# EAGLE schematic car-dashboard_v1 (EAGLE 6.5.0)

## Sheet 1 of 3
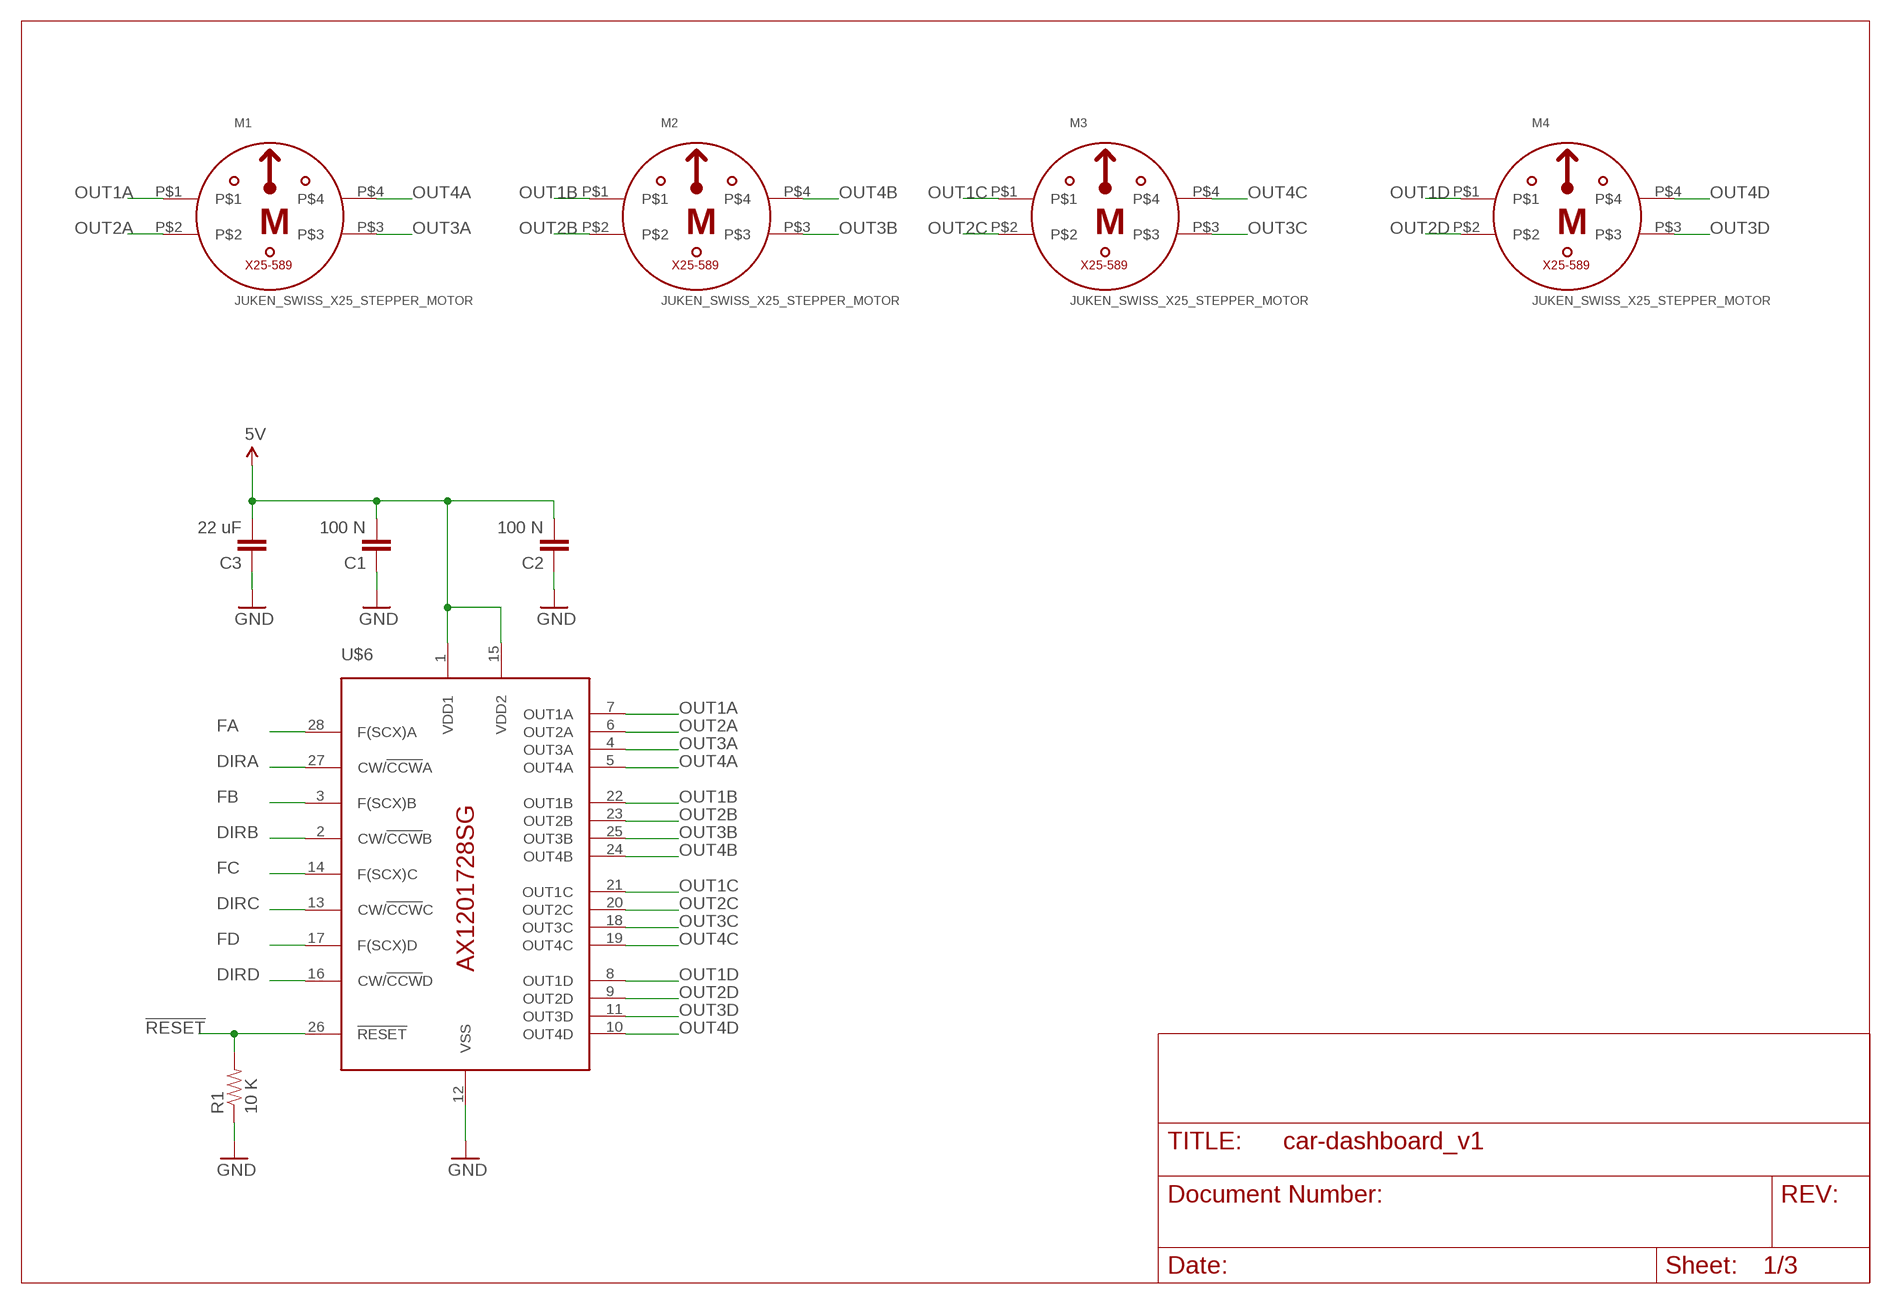
[diagram p0: schematic, sheet 1]

### Parts
C1  100 N  CAP0805  [C0805]
C2  100 N  CAP0805  [C0805]
C3  22 uF  CAP0805  [C0805]
M1  JUKEN_SWISS_X25_STEPPER_MOTOR  [X25_STEPPER_MOTOR]
M2  JUKEN_SWISS_X25_STEPPER_MOTOR  [X25_STEPPER_MOTOR]
M3  JUKEN_SWISS_X25_STEPPER_MOTOR  [X25_STEPPER_MOTOR]
M4  JUKEN_SWISS_X25_STEPPER_MOTOR  [X25_STEPPER_MOTOR]
R1  10 K  RESISTOR0805-RES  [0805]
U$6  AX1201728SG-X25_DRIVER  [SOL-28]

### Nets
5V: C1.2 C2.2 C3.2 U$6.1(VDD1) U$6.15(VDD2) ; also sheet 2,3
!RESET: R1.2 U$6.26(!RESET) ; also sheet 2
DIRA: U$6.27(CW/!CCW!A) ; also sheet 2
DIRB: U$6.2(CW/!CCW!B) ; also sheet 2
DIRC: U$6.13(CW/!CCW!C) ; also sheet 2
DIRD: U$6.16(CW/!CCW!D) ; also sheet 2
FA: U$6.28(F(SCX)A) ; also sheet 2
FB: U$6.3(F(SCX)B) ; also sheet 2
FC: U$6.14(F(SCX)C) ; also sheet 2
FD: U$6.17(F(SCX)D) ; also sheet 2
GND: C1.1 C2.1 C3.1 R1.1 U$6.12(VSS) ; also sheet 2,3
OUT1A: M1.P$1 U$6.7(OUT1A)
OUT1B: M2.P$1 U$6.22(OUT1B)
OUT1C: M3.P$1 U$6.21(OUT1C)
OUT1D: M4.P$1 U$6.8(OUT1D)
OUT2A: M1.P$2 U$6.6(OUT2A)
OUT2B: M2.P$2 U$6.23(OUT2B)
OUT2C: M3.P$2 U$6.20(OUT2C)
OUT2D: M4.P$2 U$6.9(OUT2D)
OUT3A: M1.P$3 U$6.4(OUT3A)
OUT3B: M2.P$3 U$6.25(OUT3B)
OUT3C: M3.P$3 U$6.18(OUT3C)
OUT3D: M4.P$3 U$6.11(OUT3D)
OUT4A: M1.P$4 U$6.5(OUT4A)
OUT4B: M2.P$4 U$6.24(OUT4B)
OUT4C: M3.P$4 U$6.19(OUT4C)
OUT4D: M4.P$4 U$6.10(OUT4D)

## Sheet 2 of 3
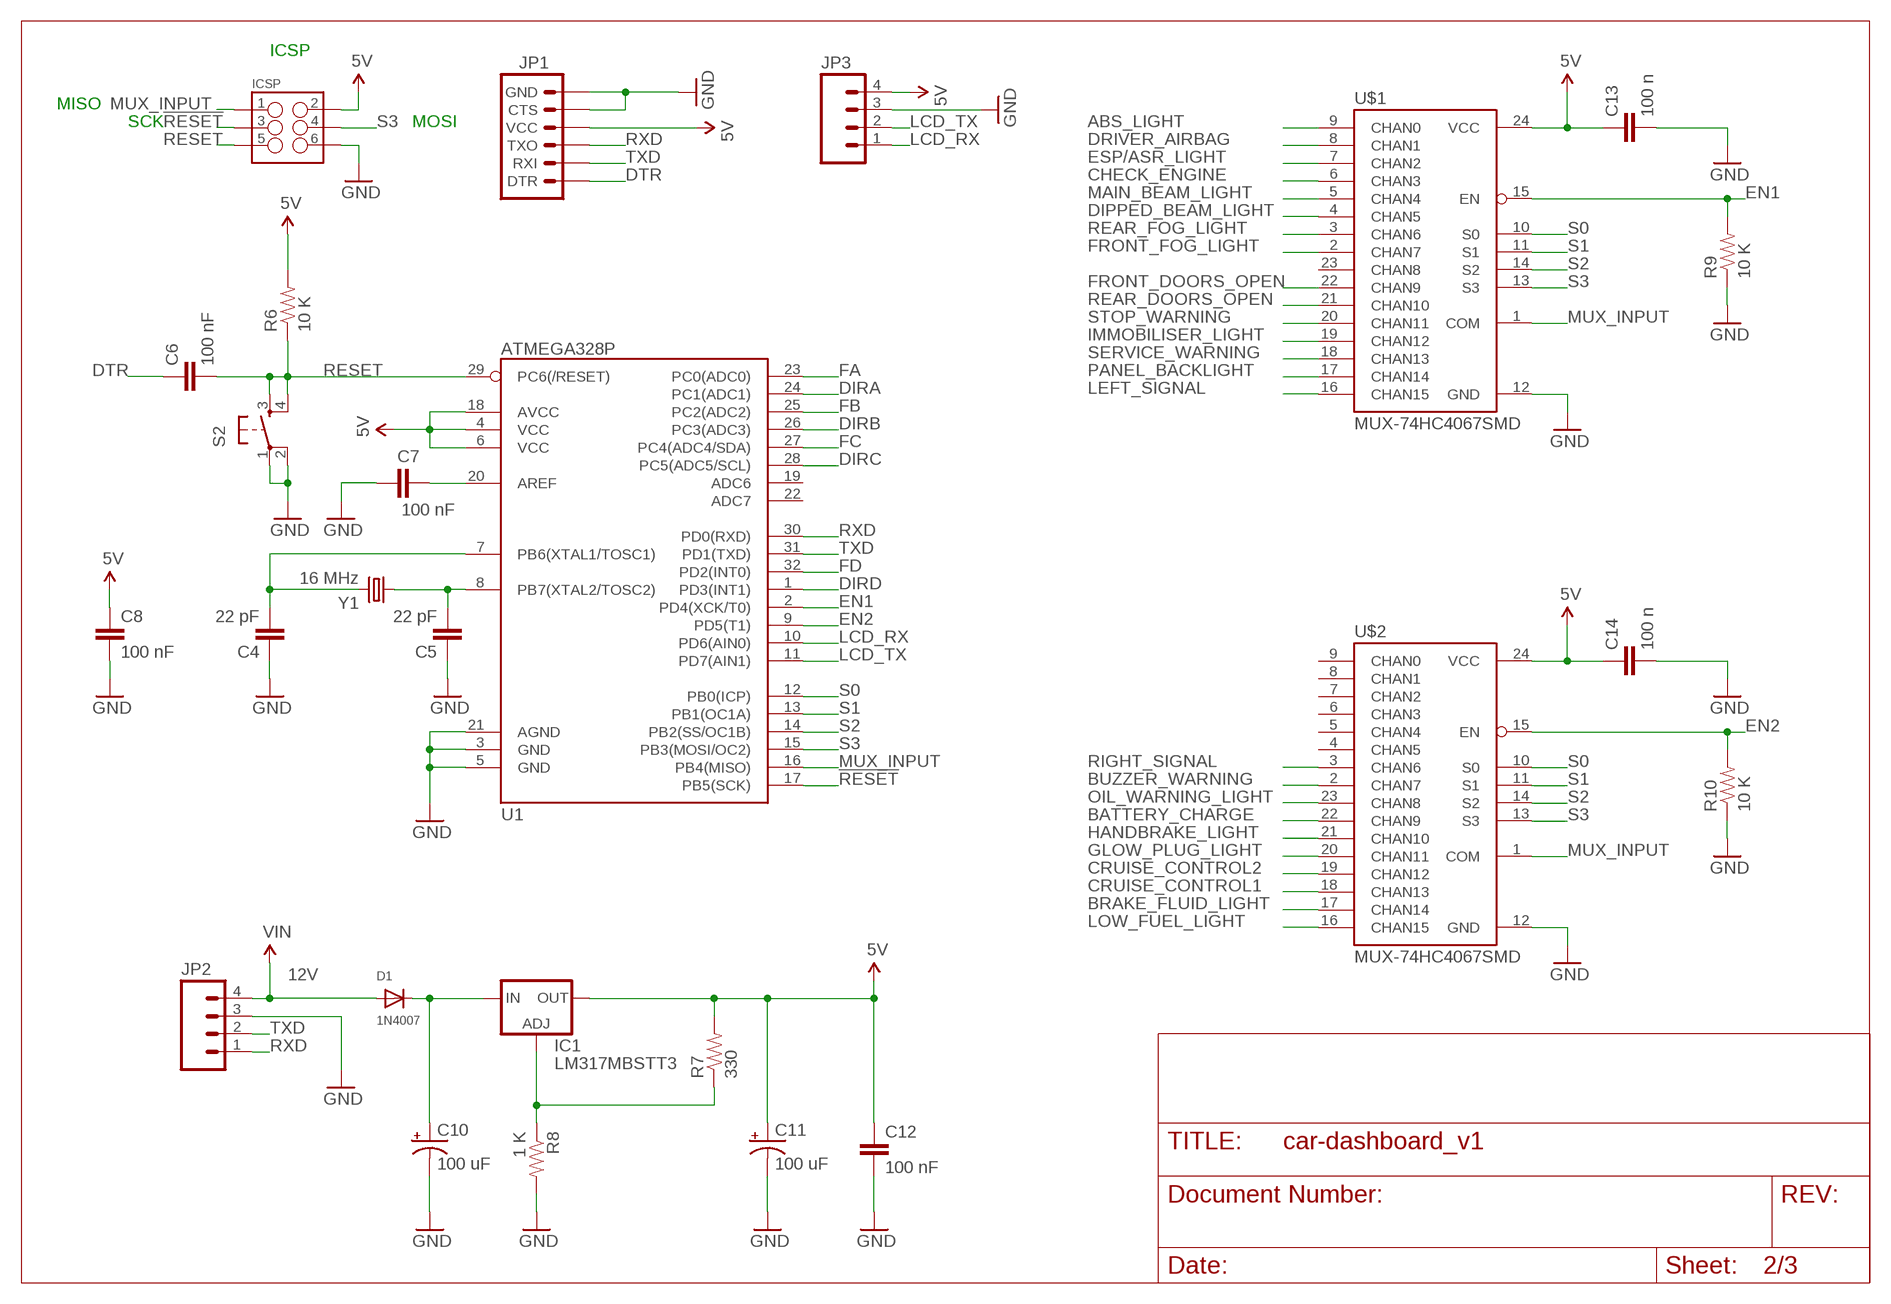
[diagram p1: schematic, sheet 2]

### Parts
C4  22 pF  CAPC0805  [C0805]
C5  22 pF  CAPC0805  [C0805]
C6  100 nF  CAPC0805  [C0805]
C7  100 nF  CAPC0805  [C0805]
C8  100 nF  CAPC0805  [C0805]
C10  100 uF  CPOL-USF  [PANASONIC_F]
C11  100 uF  CPOL-USF  [PANASONIC_F]
C12  100 nF  CAPC0805  [C0805]
C13  100 n  CAP0805  [C0805]
C14  100 n  CAP0805  [C0805]
D1  1N4007  DIODESMA  [SMADIODE]
IC1  LM317MBSTT3  [SOT223]
ICSP  M03X22X3_SILK_SM  [2X3]
JP1  ARDUINO_SERIAL_PROGRAMPTH  [1X06]
JP2  M04POLAR  [MOLEX-1X4]
JP3  M04POLAR  [MOLEX-1X4]
R6  10 K  RESISTOR0805-RES  [R0805]
R7  330  RESISTOR0805-RES  [R0805]
R8  1 K  RESISTOR0805-RES  [R0805]
R9  10 K  RESISTOR0805-RES  [R0805]
R10  10 K  RESISTOR0805-RES  [R0805]
S2  TAC_SWITCHPTH  [TACTILE-PTH]
U1  ATMEGA328P  ATMEGA328_SMT  [TQFP32-08]
U$1  MUX-74HC4067SMD  [SSOP24]
U$2  MUX-74HC4067SMD  [SSOP24]
Y1  16 MHz  CRYSTALSMD  [HC49UP]

### Nets
5V: C8.1 C11.+ C12.1 C13.1 C14.1 IC1.4(OUT) ICSP.2 JP1.4(VCC) JP3.4 R6.2 R7.2 U1.4(VCC) U1.6(VCC) U1.18(AVCC) U$1.24(VCC) U$2.24(VCC) ; also sheet 1,3
12V: D1.A JP2.4 ; supply symbol labelled VIN
!RESET: ICSP.3 U1.17(PB5(SCK)) ; also sheet 1
ABS_LIGHT: U$1.9(CHAN0) ; also sheet 3
BATTERY_CHARGE: U$2.22(CHAN9) ; also sheet 3
BRAKE_FLUID_LIGHT: U$2.17(CHAN14) ; also sheet 3
BUZZER_WARNING: U$2.2(CHAN7) ; also sheet 3
CHECK_ENGINE: U$1.6(CHAN3) ; also sheet 3
CRUISE_CONTROL1: U$2.18(CHAN13) ; also sheet 3
CRUISE_CONTROL2: U$2.19(CHAN12) ; also sheet 3
DIPPED_BEAM_LIGHT: U$1.4(CHAN5) ; also sheet 3
DIRA: U1.24(PC1(ADC1)) ; also sheet 1
DIRB: U1.26(PC3(ADC3)) ; also sheet 1
DIRC: U1.28(PC5(ADC5/SCL)) ; also sheet 1
DIRD: U1.1(PD3(INT1)) ; also sheet 1
DRIVER_AIRBAG: U$1.8(CHAN1) ; also sheet 3
DTR: C6.1 JP1.1(DTR)
EN1: R9.2 U1.2(PD4(XCK/T0)) U$1.15(EN)
EN2: R10.2 U1.9(PD5(T1)) U$2.15(EN)
ESP/ASR_LIGHT: U$1.7(CHAN2) ; also sheet 3
FA: U1.23(PC0(ADC0)) ; also sheet 1
FB: U1.25(PC2(ADC2)) ; also sheet 1
FC: U1.27(PC4(ADC4/SDA)) ; also sheet 1
FD: U1.32(PD2(INT0)) ; also sheet 1
FRONT_DOORS_OPEN: U$1.22(CHAN9) ; also sheet 3
FRONT_FOG_LIGHT: U$1.2(CHAN7) ; also sheet 3
GLOW_PLUG_LIGHT: U$2.20(CHAN11) ; also sheet 3
GND: C4.1 C5.1 C7.1 C8.2 C10.- C11.- C12.2 C13.2 C14.2 ICSP.6 JP1.5(CTS) JP1.6(GND) JP2.3 JP3.3 R8.2 R9.1 R10.1 S2.1 S2.2 U1.3(GND) U1.5(GND) U1.21(AGND) U$1.12(GND) U$2.12(GND) ; also sheet 1,3
HANDBRAKE_LIGHT: U$2.21(CHAN10) ; also sheet 3
IMMOBILISER_LIGHT: U$1.19(CHAN12) ; also sheet 3
LCD_RX: JP3.1 U1.10(PD6(AIN0))
LCD_TX: JP3.2 U1.11(PD7(AIN1))
LEFT_SIGNAL: U$1.16(CHAN15) ; also sheet 3
LOW_FUEL_LIGHT: U$2.16(CHAN15) ; also sheet 3
MAIN_BEAM_LIGHT: U$1.5(CHAN4) ; also sheet 3
MUX_INPUT: ICSP.1 U1.16(PB4(MISO)) U$1.1(COM) U$2.1(COM)
N$1: C4.2 U1.7(PB6(XTAL1/TOSC1)) Y1.2
N$3: C5.2 U1.8(PB7(XTAL2/TOSC2)) Y1.1
N$5: C10.+ D1.C IC1.3(IN)
N$9: C7.2 U1.20(AREF)
N$10: IC1.1(ADJ) R7.1 R8.1
OIL_WARNING_LIGHT: U$2.23(CHAN8) ; also sheet 3
PANEL_BACKLIGHT: U$1.17(CHAN14) ; also sheet 3
REAR_DOORS_OPEN: U$1.21(CHAN10) ; also sheet 3
REAR_FOG_LIGHT: U$1.3(CHAN6) ; also sheet 3
RESET: C6.2 ICSP.5 R6.1 S2.3 S2.4 U1.29(PC6(/RESET))
RIGHT_SIGNAL: U$2.3(CHAN6) ; also sheet 3
RXD: JP1.3(TXO) JP2.1 U1.30(PD0(RXD))
S0: U1.12(PB0(ICP)) U$1.10(S0) U$2.10(S0)
S1: U1.13(PB1(OC1A)) U$1.11(S1) U$2.11(S1)
S2: U1.14(PB2(SS/OC1B)) U$1.14(S2) U$2.14(S2)
S3: ICSP.4 U1.15(PB3(MOSI/OC2)) U$1.13(S3) U$2.13(S3)
SERVICE_WARNING: U$1.18(CHAN13) ; also sheet 3
STOP_WARNING: U$1.20(CHAN11) ; also sheet 3
TXD: JP1.2(RXI) JP2.2 U1.31(PD1(TXD))
Unconnected: U1.19(ADC6) U1.22(ADC7) U$1.23(CHAN8) U$2.4(CHAN5) U$2.5(CHAN4) U$2.6(CHAN3) U$2.7(CHAN2) U$2.8(CHAN1) U$2.9(CHAN0)

### Notes on the sheet
- ICSP
- MISO
- SCK | MOSI

## Sheet 3 of 3
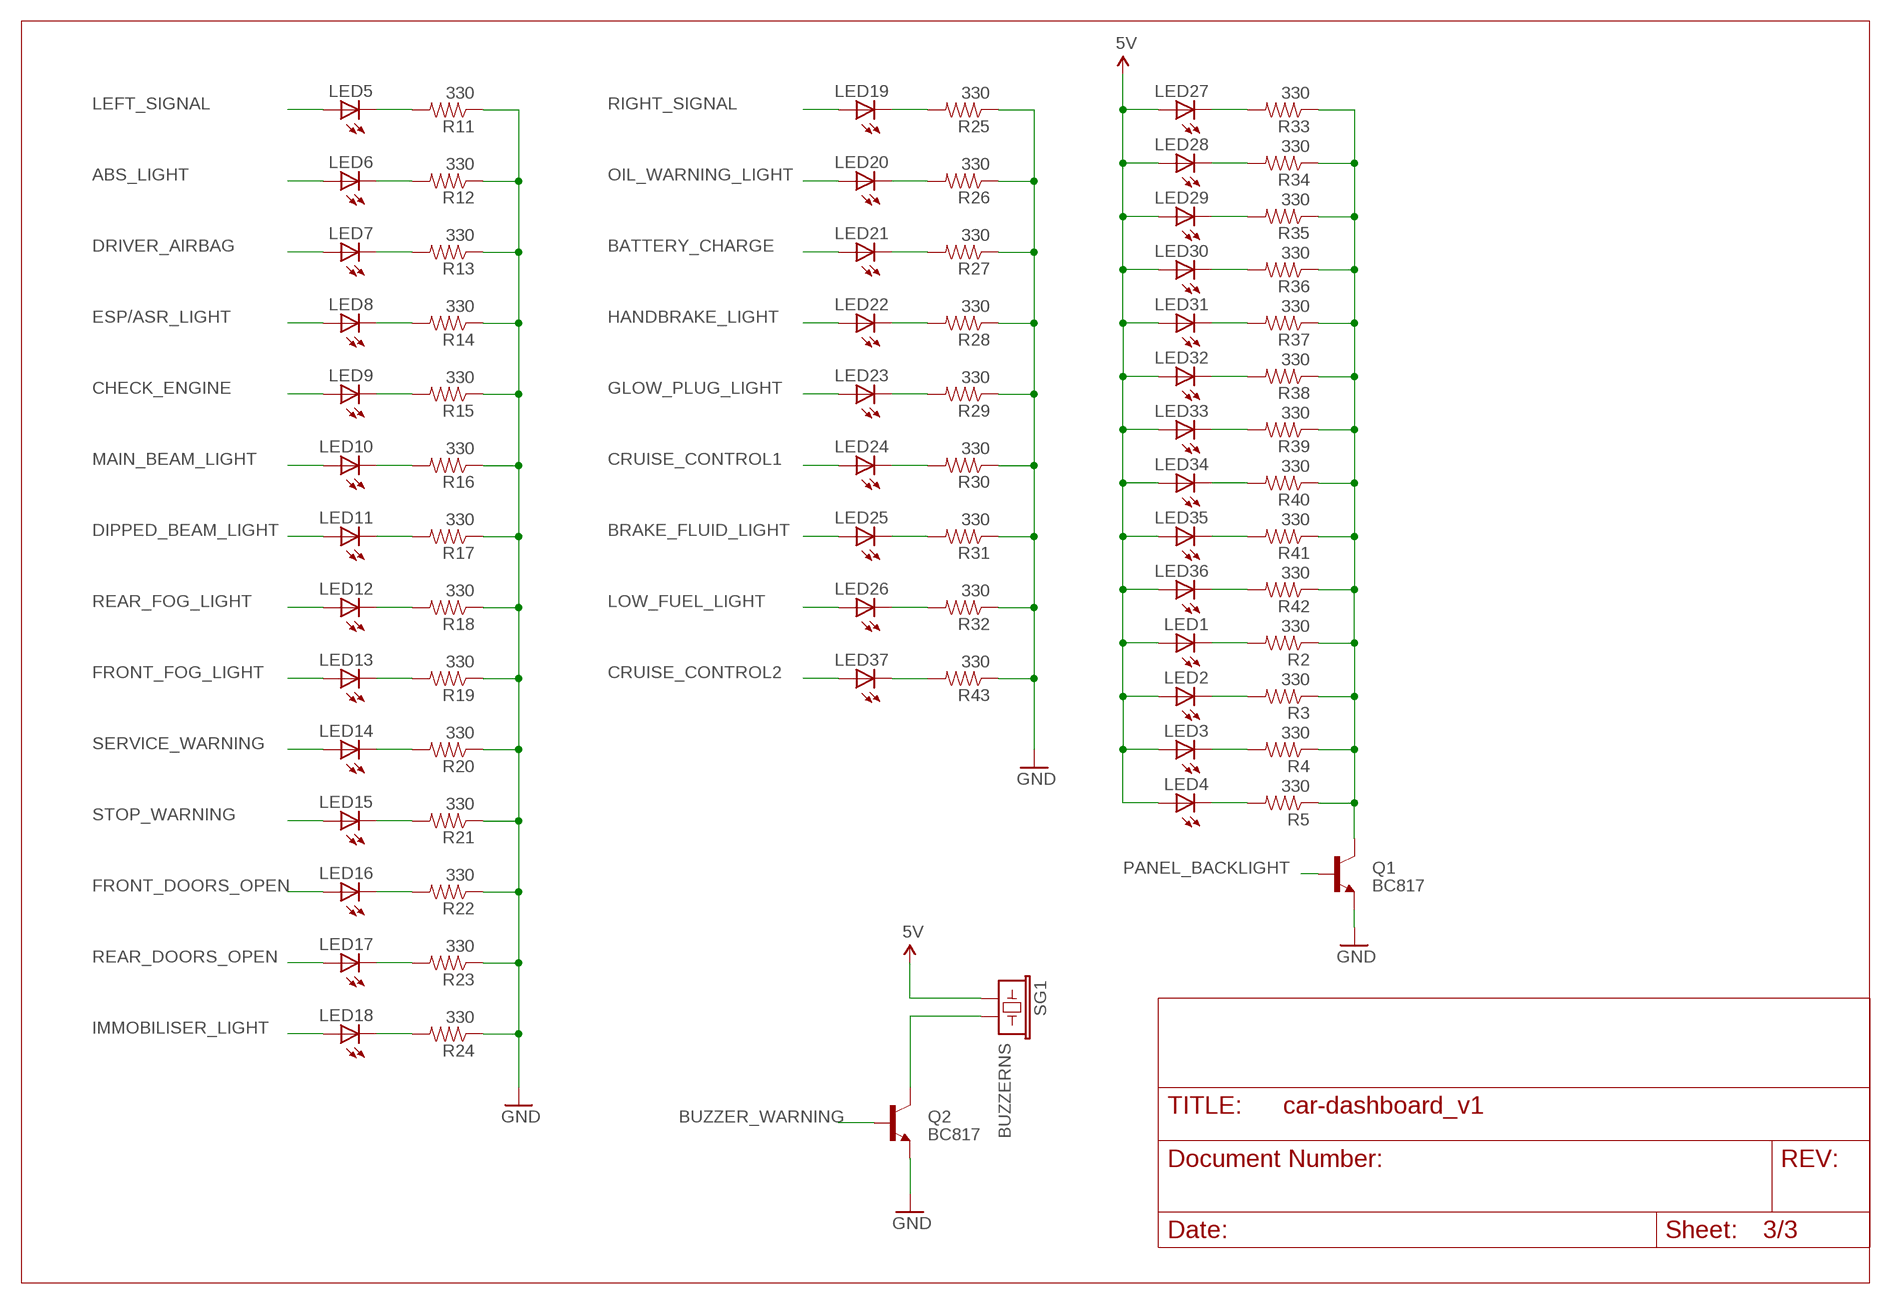
[diagram p2: schematic, sheet 3]

### Parts
LED1  LEDCHIPLED_0805  [CHIPLED_0805]
LED2  LEDCHIPLED_0805  [CHIPLED_0805]
LED3  LEDCHIPLED_0805  [CHIPLED_0805]
LED4  LEDCHIPLED_0805  [CHIPLED_0805]
LED5  LEDCHIPLED_0805  [CHIPLED_0805]
LED6  LEDCHIPLED_0805  [CHIPLED_0805]
LED7  LEDCHIPLED_0805  [CHIPLED_0805]
LED8  LEDCHIPLED_0805  [CHIPLED_0805]
LED9  LEDCHIPLED_0805  [CHIPLED_0805]
LED10  LEDCHIPLED_0805  [CHIPLED_0805]
LED11  LEDCHIPLED_0805  [CHIPLED_0805]
LED12  LEDCHIPLED_0805  [CHIPLED_0805]
LED13  LEDCHIPLED_0805  [CHIPLED_0805]
LED14  LEDCHIPLED_0805  [CHIPLED_0805]
LED15  LEDCHIPLED_0805  [CHIPLED_0805]
LED16  LEDCHIPLED_0805  [CHIPLED_0805]
LED17  LEDCHIPLED_0805  [CHIPLED_0805]
LED18  LEDCHIPLED_0805  [CHIPLED_0805]
LED19  LEDCHIPLED_0805  [CHIPLED_0805]
LED20  LEDCHIPLED_0805  [CHIPLED_0805]
LED21  LEDCHIPLED_0805  [CHIPLED_0805]
LED22  LEDCHIPLED_0805  [CHIPLED_0805]
LED23  LEDCHIPLED_0805  [CHIPLED_0805]
LED24  LEDCHIPLED_0805  [CHIPLED_0805]
LED25  LEDCHIPLED_0805  [CHIPLED_0805]
LED26  LEDCHIPLED_0805  [CHIPLED_0805]
LED27  LEDCHIPLED_0805  [CHIPLED_0805]
LED28  LEDCHIPLED_0805  [CHIPLED_0805]
LED29  LEDCHIPLED_0805  [CHIPLED_0805]
LED30  LEDCHIPLED_0805  [CHIPLED_0805]
LED31  LEDCHIPLED_0805  [CHIPLED_0805]
LED32  LEDCHIPLED_0805  [CHIPLED_0805]
LED33  LEDCHIPLED_0805  [CHIPLED_0805]
LED34  LEDCHIPLED_0805  [CHIPLED_0805]
LED35  LEDCHIPLED_0805  [CHIPLED_0805]
LED36  LEDCHIPLED_0805  [CHIPLED_0805]
LED37  LEDCHIPLED_0805  [CHIPLED_0805]
Q1  BC817  TRANSISTOR_NPNSOT23-3  [SOT23-3]
Q2  BC817  TRANSISTOR_NPNSOT23-3  [SOT23-3]
R2  330  RESISTOR0805-RES  [0805]
R3  330  RESISTOR0805-RES  [0805]
R4  330  RESISTOR0805-RES  [0805]
R5  330  RESISTOR0805-RES  [0805]
R11  330  RESISTOR0805-RES  [0805]
R12  330  RESISTOR0805-RES  [0805]
R13  330  RESISTOR0805-RES  [0805]
R14  330  RESISTOR0805-RES  [0805]
R15  330  RESISTOR0805-RES  [0805]
R16  330  RESISTOR0805-RES  [0805]
R17  330  RESISTOR0805-RES  [0805]
R18  330  RESISTOR0805-RES  [0805]
R19  330  RESISTOR0805-RES  [0805]
R20  330  RESISTOR0805-RES  [0805]
R21  330  RESISTOR0805-RES  [0805]
R22  330  RESISTOR0805-RES  [0805]
R23  330  RESISTOR0805-RES  [0805]
R24  330  RESISTOR0805-RES  [0805]
R25  330  RESISTOR0805-RES  [0805]
R26  330  RESISTOR0805-RES  [0805]
R27  330  RESISTOR0805-RES  [0805]
R28  330  RESISTOR0805-RES  [0805]
R29  330  RESISTOR0805-RES  [0805]
R30  330  RESISTOR0805-RES  [0805]
R31  330  RESISTOR0805-RES  [0805]
R32  330  RESISTOR0805-RES  [0805]
R33  330  RESISTOR0805-RES  [0805]
R34  330  RESISTOR0805-RES  [0805]
R35  330  RESISTOR0805-RES  [0805]
R36  330  RESISTOR0805-RES  [0805]
R37  330  RESISTOR0805-RES  [0805]
R38  330  RESISTOR0805-RES  [0805]
R39  330  RESISTOR0805-RES  [0805]
R40  330  RESISTOR0805-RES  [0805]
R41  330  RESISTOR0805-RES  [0805]
R42  330  RESISTOR0805-RES  [0805]
R43  330  RESISTOR0805-RES  [0805]
SG1  BUZZERNS  [BUZZER-12MM-NS]

### Nets
5V: LED1.A LED2.A LED3.A LED4.A LED27.A LED28.A LED29.A LED30.A LED31.A LED32.A LED33.A LED34.A LED35.A LED36.A SG1.+ ; also sheet 1,2
ABS_LIGHT: LED6.A ; also sheet 2
BATTERY_CHARGE: LED21.A ; also sheet 2
BRAKE_FLUID_LIGHT: LED25.A ; also sheet 2
BUZZER_WARNING: Q2.1(B) ; also sheet 2
CHECK_ENGINE: LED9.A ; also sheet 2
CRUISE_CONTROL1: LED24.A ; also sheet 2
CRUISE_CONTROL2: LED37.A ; also sheet 2
DIPPED_BEAM_LIGHT: LED11.A ; also sheet 2
DRIVER_AIRBAG: LED7.A ; also sheet 2
ESP/ASR_LIGHT: LED8.A ; also sheet 2
FRONT_DOORS_OPEN: LED16.A ; also sheet 2
FRONT_FOG_LIGHT: LED13.A ; also sheet 2
GLOW_PLUG_LIGHT: LED23.A ; also sheet 2
GND: Q1.2(E) Q2.2(E) R11.1 R12.1 R13.1 R14.1 R15.1 R16.1 R17.1 R18.1 R19.1 R20.1 R21.1 R22.1 R23.1 R24.1 R25.1 R26.1 R27.1 R28.1 R29.1 R30.1 R31.1 R32.1 R43.1 ; also sheet 1,2
HANDBRAKE_LIGHT: LED22.A ; also sheet 2
IMMOBILISER_LIGHT: LED18.A ; also sheet 2
LEFT_SIGNAL: LED5.A ; also sheet 2
LOW_FUEL_LIGHT: LED26.A ; also sheet 2
MAIN_BEAM_LIGHT: LED10.A ; also sheet 2
N$2: LED1.C R2.2
N$4: LED2.C R3.2
N$6: LED3.C R4.2
N$8: LED4.C R5.2
N$11: LED5.C R11.2
N$12: LED6.C R12.2
N$13: LED7.C R13.2
N$14: LED8.C R14.2
N$15: LED9.C R15.2
N$16: LED10.C R16.2
N$17: LED11.C R17.2
N$18: LED12.C R18.2
N$19: LED37.C R43.2
N$20: LED13.C R19.2
N$21: LED14.C R20.2
N$22: LED15.C R21.2
N$23: LED16.C R22.2
N$24: LED17.C R23.2
N$25: LED18.C R24.2
N$26: LED19.C R25.2
N$27: LED20.C R26.2
N$28: LED21.C R27.2
N$30: LED22.C R28.2
N$31: LED23.C R29.2
N$32: LED24.C R30.2
N$33: LED25.C R31.2
N$34: LED26.C R32.2
N$35: LED27.C R33.2
N$36: LED28.C R34.2
N$37: LED29.C R35.2
N$38: LED30.C R36.2
N$39: LED31.C R37.2
N$41: Q1.3(C) R2.1 R3.1 R4.1 R5.1 R33.1 R34.1 R35.1 R36.1 R37.1 R38.1 R39.1 R40.1 R41.1 R42.1
N$42: LED32.C R38.2
N$43: LED33.C R39.2
N$44: LED34.C R40.2
N$45: LED35.C R41.2
N$46: LED36.C R42.2
N$48: Q2.3(C) SG1.-
OIL_WARNING_LIGHT: LED20.A ; also sheet 2
PANEL_BACKLIGHT: Q1.1(B) ; also sheet 2
REAR_DOORS_OPEN: LED17.A ; also sheet 2
REAR_FOG_LIGHT: LED12.A ; also sheet 2
RIGHT_SIGNAL: LED19.A ; also sheet 2
SERVICE_WARNING: LED14.A ; also sheet 2
STOP_WARNING: LED15.A ; also sheet 2

## Library data of the parts
C1-C3 C13 C14 = SparkFun-Capacitors:CAP: Capacitor Standard 0603 ceramic capacitor, and 0.1" leaded capacitor.
C4-C8 C12 = SparkFun-Passives:CAP: Capacitor Standard 0603 ceramic capacitor, and 0.1" leaded capacitor.
C10 C11 = adafruit:CPOL-US: POLARIZED CAPACITOR, American symbol
D1 = adafruit:DIODE: Diode SMADIODE - SMA Surface Mount Package 20V 1A Schottky Diode Digikey: 641-1014-6-ND DO-1N4148 - Through Hole Small Current Diode SOD-123 20V 1 A (.5mV Vf) Schottky Diode - Digikey: MBRX120TPMSCT-ND SOD-323 10V 570mA (.38mV Vf, 3ns) Schottky Diode - Digikey: ZLLS410CT-ND SOD-523 30V 30mA Schottky Diode (RB751S-40TE61) - Digikey: RB751S-40TE61CT-ND SOT23-R/W - SOT23 Package (R = Solder Paste/Reflow Ovens, W = Hand-Soldering) BAT54Film 40V 300mA - Digikey: 497-7162-1-ND
IC1 = v-reg:LM317?*: 500 mA Adjustable Output Positive Voltage Regulator Source: http://www.onsemi.co.jp .. LM317M-D.PDF
ICSP = SparkFun-Connectors:M03X2: 2x3 .1" header. Shrouded, with keying- CONN-10681 SMT- CONN-11415 Pogo pins- HW-11044
JP1 = SparkFun-Connectors:ARDUINO_SERIAL_PROGRAM: FTDI connector footprints
JP2 JP3 = SparkFun-Connectors:M04: Header 4 Standard 4-pin 0.1" header. Use with straight break away headers (SKU : PRT-00116), right angle break away headers (PRT-00553), swiss pins (PRT-00743), machine pins (PRT-00117), and female headers (PRT-00115). Molex polarized connector foot print use with SKU : PRT-08231 with associated crimp pins and housings. 1MM SMD Version SKU: PRT-10208
LED1-LED37 = led:LED: LED OSRAM: - CHIPLED LG R971, LG N971, LY N971, LG Q971, LY Q971, LO R971, LY R971 LH N974, LH R974 LS Q976, LO Q976, LY Q976 LO Q996 - Hyper CHIPLED LW Q18S LB Q993, LB Q99A, LB R99A - SideLED LS A670, LO A670, LY A670, LG A670, LP A670 LB A673, LV A673, LT A673, LW A673 LH A674 LY A675 LS A676, LA A676, LO A676, LY A676, LW A676 LS A679, LY A679, LG A679 - Hyper Micro SIDELED® LS Y876, LA Y876, LO Y876, LY Y876 LT Y87S - SmartLED LW L88C, LW L88S LB L89C, LB L89S, LG L890 LS L89K, LO L89K, LY L89K LS L896, LA L896, LO L896, LY L896 - TOPLED LS T670, LO T670, LY T670, LG T670, LP T670 LSG T670, LSP T670, LSY T670, LOP T670, LYG T670 LG T671, LOG T671, LSG T671 LB T673, LV T673, LT T673, LW T673 LH T674 LS T676, LA T676, LO T676, LY T676, LB T676, LH T676, LSB T676, LW T676 LB T67C, LV T67C, LT T67C, LS T67K, LO T67K, LY T67K, LW E67C LS E67B, LA E67B, LO E67B, LY E67B, LB E67C, LV E67C, LT E67C LW T67C LS T679, LY T679, LG T679 LS T770, LO T770, LY T770, LG T770, LP T770 LB T773, LV T773, LT T773, LW T773 LH T774 LS E675, LA E675, LY E675, LS T675 LS T776, LA T776, LO T776, LY T776, LB T776 LHGB T686 LT T68C, LB T68C - Hyper Mini TOPLED® LB M676 - Mini TOPLED Santana® LG M470 LS M47K, LO M47K, LY M47K Source: http://www.osram.convergy.de LUXEON: - LUMILED® LXK2-PW12-R00, LXK2-PW12-S00, LXK2-PW14-U00, LXK2-PW14-V00 LXK2-PM12-R00, LXK2-PM12-S00, LXK2-PM14-U00 LXK2-PE12-Q00, LXK2-PE12-R00, LXK2-PE12-S00, LXK2-PE14-T00, LXK2-PE14-U00 LXK2-PB12-K00, LXK2-PB12-L00, LXK2-PB12-M00, LXK2-PB14-N00, LXK2-PB14-P00, LXK2-PB14-Q00 LXK2-PR12-L00, LXK2-PR12-M00, LXK2-PR14-Q00, LXK2-PR14-R00 LXK2-PD12-Q00, LXK2-PD12-R00, LXK2-PD12-S00 LXK2-PH12-R00, LXK2-PH12-S00 LXK2-PL12-P00, LXK2-PL12-Q00, LXK2-PL12-R00 Source: www.luxeon.com KINGBRIGHT: KA-3528ASYC Source: www.kingbright.com
M1-M4 = robit_teknoloji:JUKEN_SWISS_X25_STEPPER_MOTOR: JUKEN SWISS X25 STEPPER MOTOR
Q1 Q2 = SparkFun-DiscreteSemi:TRANSISTOR_NPN: Generic NPN BJT. MMBT2222 is the common NPN we use. Double check against datasheet- not all devices are the same!
R1-R5 R11-R43 = SparkFun-Resistors:RESISTOR: Resistor Basic schematic elements and footprints for 0603, 1206, and PTH resistors.
R6-R10 = SparkFun-Passives:RESISTOR: Resistor Basic schematic elements and footprints for 0603, 1206, and PTH resistors.
S2 = SparkFun-Electromechanical:TAC_SWITCH: Momentary Switch Button commonly used for reset or general input. Spark Fun Electronics SKU : COM-00097 SMT- SWCH-08247
SG1 = SparkFun-Electromechanical:BUZZER: Buzzer 12mm Spark Fun Electronics SKU : Comp-Buzzer
U1 = SparkFun-DigitalIC:ATMEGA328_SMT: 32-Pin Atmega328 part Commonly used on Arduino compatible boards Available in QFP and QFN packages TQFP is IC-09069 QFN is non-stock; PROD_ID: IC-09069
U$1 U$2 = SparkFun-AnalogIC:MUX-74HC4067: 16-channel analog MUX
U$6 = robit_teknoloji:AX1201728SG-X25_DRIVER: X25 MICRO STEPPER MOTOR DRIVER
Y1 = SparkFun-FreqCtrl:CRYSTAL: Various standard crystals. Proven footprints. Spark Fun Electronics SKU : COM-00534